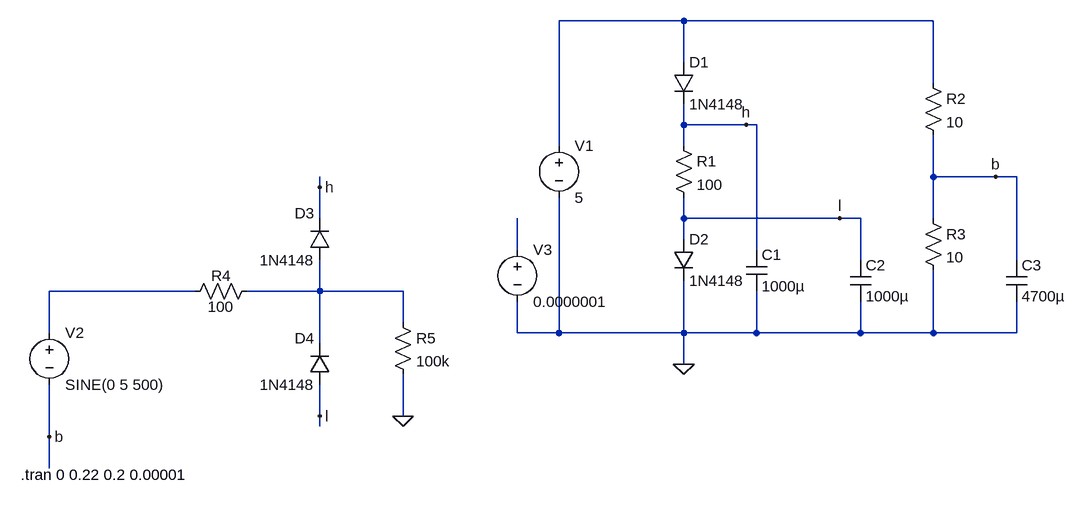
[diagram p0: schematic Power Board.asc]
Power Board.asc, the LTspice schematic file:
Version 4
SHEET 1 880 776
WIRE 64 -64 -128 -64
WIRE 448 -64 64 -64
WIRE 64 0 64 -64
WIRE 448 32 448 -64
WIRE 64 96 64 64
WIRE 160 96 64 96
WIRE 176 96 160 96
WIRE -128 128 -128 -64
WIRE 64 128 64 96
WIRE 448 176 448 112
WIRE 544 176 448 176
WIRE 576 176 544 176
WIRE -496 192 -496 176
WIRE -496 240 -496 192
WIRE 64 240 64 208
WIRE 304 240 64 240
WIRE 336 240 304 240
WIRE 448 240 448 176
WIRE 64 272 64 240
WIRE -192 288 -192 240
WIRE 176 288 176 96
WIRE 336 304 336 240
WIRE 576 304 576 176
WIRE -688 352 -912 352
WIRE -496 352 -496 304
WIRE -496 352 -608 352
WIRE -368 352 -496 352
WIRE -368 400 -368 352
WIRE -912 416 -912 352
WIRE -192 416 -192 368
WIRE -128 416 -128 208
WIRE -128 416 -192 416
WIRE 64 416 64 336
WIRE 64 416 -128 416
WIRE 176 416 176 352
WIRE 176 416 64 416
WIRE 336 416 336 368
WIRE 336 416 176 416
WIRE 448 416 448 320
WIRE 448 416 336 416
WIRE 576 416 576 368
WIRE 576 416 448 416
WIRE -496 432 -496 352
WIRE 64 464 64 416
WIRE -496 544 -496 496
WIRE -368 544 -368 480
WIRE -496 560 -496 544
WIRE -912 576 -912 496
WIRE -912 624 -912 576
FLAG 160 96 h
FLAG 304 240 l
FLAG 544 176 b
FLAG -912 576 b
FLAG -368 544 0
FLAG -496 544 l
FLAG -496 192 h
FLAG 64 464 0
SYMBOL res 48 112 R0
SYMATTR InstName R1
SYMATTR Value 100
SYMBOL diode 48 0 R0
SYMATTR InstName D1
SYMATTR Value 1N4148
SYMBOL diode 48 272 R0
SYMATTR InstName D2
SYMATTR Value 1N4148
SYMBOL voltage -128 112 R0
WINDOW 123 0 0 Left 2
WINDOW 39 0 0 Left 2
SYMATTR InstName V1
SYMATTR Value 5
SYMBOL cap 160 288 R0
SYMATTR InstName C1
SYMATTR Value 1000µ
SYMBOL cap 320 304 R0
SYMATTR InstName C2
SYMATTR Value 1000µ
SYMBOL voltage -912 400 R0
WINDOW 123 0 0 Left 2
WINDOW 39 0 0 Left 2
SYMATTR InstName V2
SYMATTR Value SINE(0 5 500)
SYMBOL res 432 16 R0
SYMATTR InstName R2
SYMATTR Value 10
SYMBOL res 432 224 R0
SYMATTR InstName R3
SYMATTR Value 10
SYMBOL cap 560 304 R0
SYMATTR InstName C3
SYMATTR Value 4700µ
SYMBOL res -592 336 R90
WINDOW 0 8 56 VBottom 2
WINDOW 3 24 56 VTop 2
SYMATTR InstName R4
SYMATTR Value 100
SYMBOL diode -480 304 R180
WINDOW 0 24 72 Left 2
WINDOW 3 24 0 Left 2
SYMATTR InstName D3
SYMATTR Value 1N4148
SYMBOL diode -480 496 R180
WINDOW 0 24 72 Left 2
WINDOW 3 24 0 Left 2
SYMATTR InstName D4
SYMATTR Value 1N4148
SYMBOL res -384 384 R0
SYMATTR InstName R5
SYMATTR Value 100k
SYMBOL voltage -192 272 R0
WINDOW 123 0 0 Left 2
WINDOW 39 0 0 Left 2
SYMATTR InstName V3
SYMATTR Value 0.0000001
TEXT -956 634 Left 2 !.tran 0 0.22 0.2 0.00001

The netlist it stands for:
* Power Board.asc
R1 h l 100
D1 N001 h 1N4148
D2 l 0 1N4148
V1 N001 0 5
C1 h 0 1000µ
C2 l 0 1000µ
V2 N003 b SINE(0 5 500)
R2 N001 b 10
R3 b 0 10
C3 b 0 4700µ
R4 N004 N003 100
D3 N004 h 1N4148
D4 l N004 1N4148
R5 N004 0 100k
V3 N002 0 0.0000001
.model D D
.lib standard.dio
.tran 0 0.22 0.2 0.00001
.backanno
.end

* Results of the author's LTspice run, read from the files saved beside the schematic
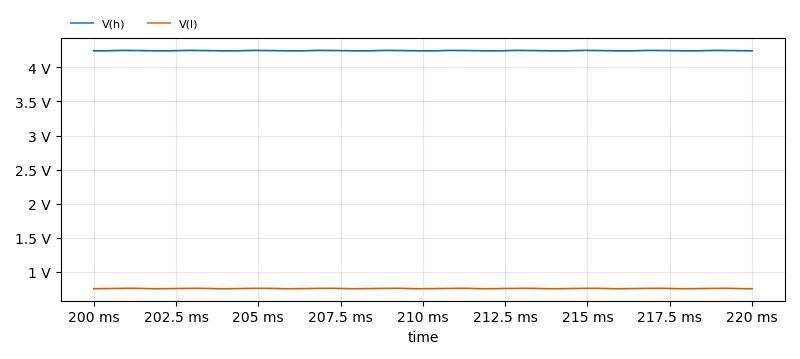
[diagram p1: Transient Analysis of Power Board.asc, plotted from the saved traces]
* Transient Analysis, 1 run:
*   V(h): min 4.243 V, max 4.25 V, average 4.246 V, rms 4.246 V, last 4.243 V
*   V(l): min 749.9 mV, max 757.4 mV, average 753.9 mV, rms 753.9 mV, last 751.3 mV